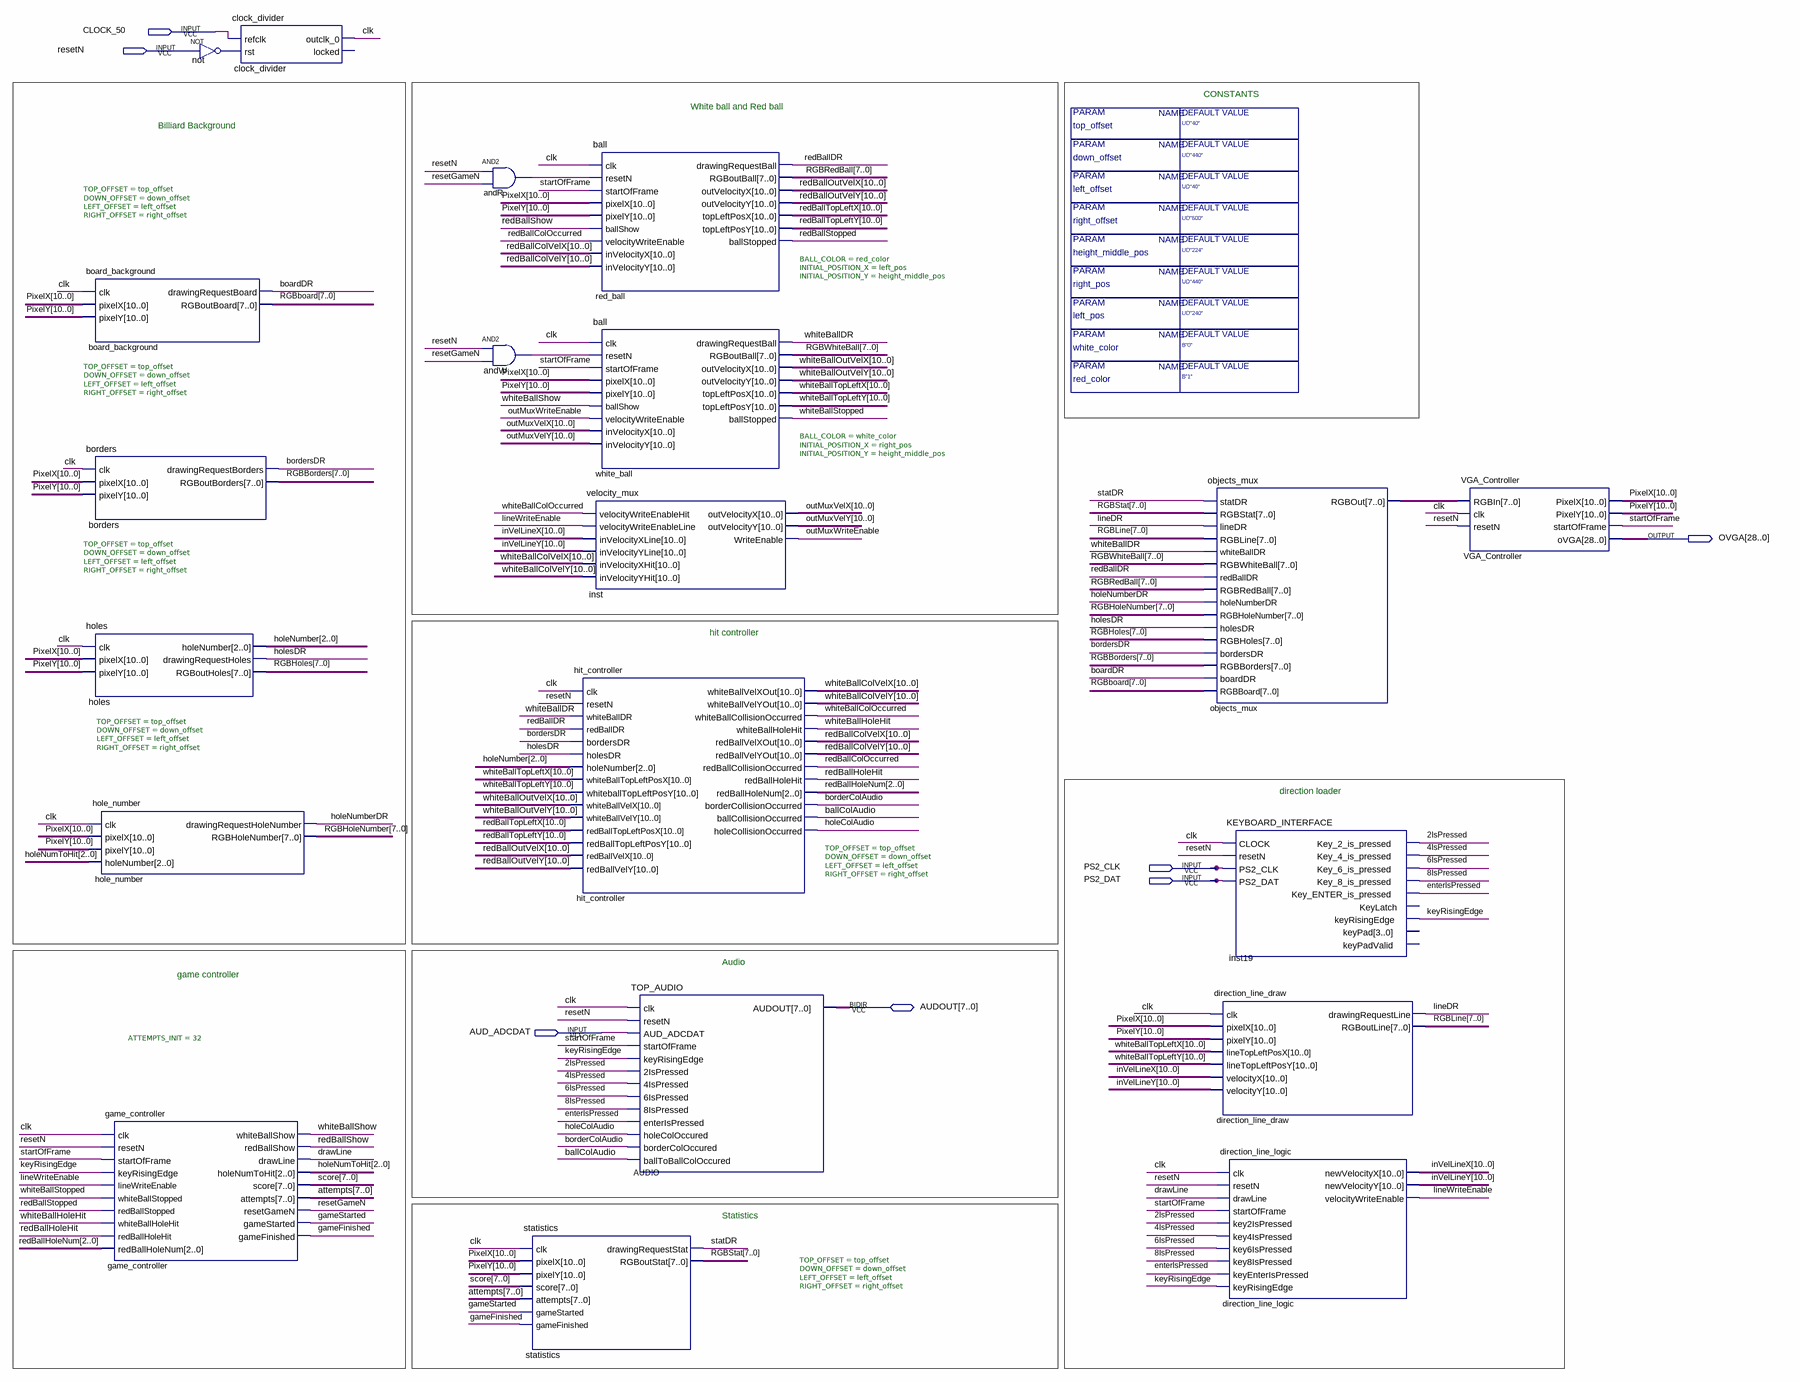
[diagram p0: schematic sheet]
// Quartus schematic BILLIARD_GAME.bdf as structural Verilog: 20 symbols, 7 pins
module BILLIARD_GAME #(parameter height_middle_pos = "UD\"224\"", parameter right_pos = "UD\"440\"", parameter left_pos = "UD\"240\"", parameter white_color = 'b0, parameter red_color = 'b1, parameter top_offset = "UD\"40\"", parameter down_offset = "UD\"440\"", parameter left_offset = "UD\"40\"", parameter right_offset = "UD\"600\"") (
  input  CLOCK_50,
  input  resetN,
  input  PS2_CLK,
  input  PS2_DAT,
  input  AUD_ADCDAT,
  inout  [7:0] AUDOUT,
  output [28:0] OVGA
);

  wire \2IsPressed , \4IsPressed , \6IsPressed , \8IsPressed , andR_out, andW_out, ballColAudio, boardDR,
       borderColAudio, bordersDR, clk, drawLine, enterIsPressed, gameFinished, gameStarted, holeColAudio,
       holeNumberDR, holesDR, keyRisingEdge, lineDR, lineWriteEnable, not_out, outMuxWriteEnable,
       redBallColOccurred, redBallDR, redBallHoleHit, redBallShow, redBallStopped, resetGameN, startOfFrame,
       statDR, whiteBallColOccurred, whiteBallDR, whiteBallHoleHit, whiteBallShow, whiteBallStopped;
  wire [2:0] holeNumber, holeNumToHit, redBallHoleNum;
  wire [7:0] attempts, objects_mux_rgbout, RGBboard, RGBBorders, RGBHoleNumber, RGBHoles, RGBLine,
       RGBRedBall, RGBStat, RGBWhiteBall, score;
  wire [10:0] inVelLineX, inVelLineY, outMuxVelX, outMuxVelY, PixelX, PixelY, redBallColVelX, redBallColVelY,
       redBallOutVelX, redBallOutVelY, redBallTopLeftX, redBallTopLeftY, whiteBallColVelX, whiteBallColVelY,
       whiteBallOutVelX, whiteBallOutVelY, whiteBallTopLeftX, whiteBallTopLeftY;

  board_background #(.TOP_OFFSET(top_offset), .DOWN_OFFSET(down_offset), .LEFT_OFFSET(left_offset), .RIGHT_OFFSET(right_offset)) board_background (
    .clk(clk), .pixelX(PixelX), .pixelY(PixelY), .drawingRequestBoard(boardDR), .RGBoutBoard(RGBboard));
  borders #(.TOP_OFFSET(top_offset), .DOWN_OFFSET(down_offset), .LEFT_OFFSET(left_offset), .RIGHT_OFFSET(right_offset)) borders (
    .clk(clk), .pixelX(PixelX), .pixelY(PixelY), .drawingRequestBorders(bordersDR), .RGBoutBorders(RGBBorders));
  holes #(.TOP_OFFSET(top_offset), .DOWN_OFFSET(down_offset), .LEFT_OFFSET(left_offset), .RIGHT_OFFSET(right_offset)) holes (
    .clk(clk), .pixelX(PixelX), .pixelY(PixelY), .holeNumber(holeNumber), .drawingRequestHoles(holesDR),
    .RGBoutHoles(RGBHoles));
  hole_number #(.TOP_OFFSET(top_offset), .DOWN_OFFSET(down_offset), .LEFT_OFFSET(left_offset), .RIGHT_OFFSET(right_offset)) hole_number (
    .clk(clk), .pixelX(PixelX), .pixelY(PixelY), .holeNumber(holeNumToHit),
    .drawingRequestHoleNumber(holeNumberDR), .RGBHoleNumber(RGBHoleNumber));
  game_controller #(.ATTEMPTS_INIT(32)) game_controller (
    .clk(clk), .resetN(resetN), .startOfFrame(startOfFrame), .keyRisingEdge(keyRisingEdge),
    .lineWriteEnable(lineWriteEnable), .whiteBallStopped(whiteBallStopped), .redBallStopped(redBallStopped),
    .whiteBallHoleHit(whiteBallHoleHit), .redBallHoleHit(redBallHoleHit), .redBallHoleNum(redBallHoleNum),
    .whiteBallShow(whiteBallShow), .redBallShow(redBallShow), .drawLine(drawLine),
    .holeNumToHit(holeNumToHit), .score(score), .attempts(attempts), .resetGameN(resetGameN),
    .gameStarted(gameStarted), .gameFinished(gameFinished));
  clock_divider clock_divider (.refclk(CLOCK_50), .rst(not_out), .outclk_0(clk));  // open: locked
  not \not  (not_out, resetN);
  and andR (andR_out, resetN, resetGameN);
  and andW (andW_out, resetN, resetGameN);
  statistics #(.TOP_OFFSET(top_offset), .DOWN_OFFSET(down_offset), .LEFT_OFFSET(left_offset), .RIGHT_OFFSET(right_offset)) statistics (
    .clk(clk), .pixelX(PixelX), .pixelY(PixelY), .score(score), .attempts(attempts),
    .gameStarted(gameStarted), .gameFinished(gameFinished), .drawingRequestStat(statDR), .RGBoutStat(RGBStat));
  ball #(.BALL_COLOR(red_color), .INITIAL_POSITION_X(left_pos), .INITIAL_POSITION_Y(height_middle_pos)) red_ball (
    .clk(clk), .resetN(andR_out), .startOfFrame(startOfFrame), .pixelX(PixelX), .pixelY(PixelY),
    .ballShow(redBallShow), .velocityWriteEnable(redBallColOccurred), .inVelocityX(redBallColVelX),
    .inVelocityY(redBallColVelY), .drawingRequestBall(redBallDR), .RGBoutBall(RGBRedBall),
    .outVelocityX(redBallOutVelX), .outVelocityY(redBallOutVelY), .topLeftPosX(redBallTopLeftX),
    .topLeftPosY(redBallTopLeftY), .ballStopped(redBallStopped));
  ball #(.BALL_COLOR(white_color), .INITIAL_POSITION_X(right_pos), .INITIAL_POSITION_Y(height_middle_pos)) white_ball (
    .clk(clk), .resetN(andW_out), .startOfFrame(startOfFrame), .pixelX(PixelX), .pixelY(PixelY),
    .ballShow(whiteBallShow), .velocityWriteEnable(outMuxWriteEnable), .inVelocityX(outMuxVelX),
    .inVelocityY(outMuxVelY), .drawingRequestBall(whiteBallDR), .RGBoutBall(RGBWhiteBall),
    .outVelocityX(whiteBallOutVelX), .outVelocityY(whiteBallOutVelY), .topLeftPosX(whiteBallTopLeftX),
    .topLeftPosY(whiteBallTopLeftY), .ballStopped(whiteBallStopped));
  velocity_mux inst (
    .velocityWriteEnableHit(whiteBallColOccurred), .velocityWriteEnableLine(lineWriteEnable),
    .inVelocityXLine(inVelLineX), .inVelocityYLine(inVelLineY), .inVelocityXHit(whiteBallColVelX),
    .inVelocityYHit(whiteBallColVelY), .outVelocityX(outMuxVelX), .outVelocityY(outMuxVelY),
    .WriteEnable(outMuxWriteEnable));
  hit_controller #(.TOP_OFFSET(top_offset), .DOWN_OFFSET(down_offset), .LEFT_OFFSET(left_offset), .RIGHT_OFFSET(right_offset)) hit_controller (
    .clk(clk), .resetN(resetN), .whiteBallDR(whiteBallDR), .redBallDR(redBallDR), .bordersDR(bordersDR),
    .holesDR(holesDR), .holeNumber(holeNumber), .whiteBallTopLeftPosX(whiteBallTopLeftX),
    .whiteballTopLeftPosY(whiteBallTopLeftY), .whiteBallVelX(whiteBallOutVelX),
    .whiteBallVelY(whiteBallOutVelY), .redBallTopLeftPosX(redBallTopLeftX),
    .redBallTopLeftPosY(redBallTopLeftY), .redBallVelX(redBallOutVelX), .redBallVelY(redBallOutVelY),
    .whiteBallVelXOut(whiteBallColVelX), .whiteBallVelYOut(whiteBallColVelY),
    .whiteBallCollisionOccurred(whiteBallColOccurred), .whiteBallHoleHit(whiteBallHoleHit),
    .redBallVelXOut(redBallColVelX), .redBallVelYOut(redBallColVelY),
    .redBallCollisionOccurred(redBallColOccurred), .redBallHoleHit(redBallHoleHit),
    .redBallHoleNum(redBallHoleNum), .borderCollisionOccurred(borderColAudio),
    .ballCollisionOccurred(ballColAudio), .holeCollisionOccurred(holeColAudio));
  TOP_AUDIO AUDIO (
    .clk(clk), .resetN(resetN), .AUD_ADCDAT(AUD_ADCDAT), .startOfFrame(startOfFrame),
    .keyRisingEdge(keyRisingEdge), .\2IsPressed (\2IsPressed ), .\4IsPressed (\4IsPressed ),
    .\6IsPressed (\6IsPressed ), .\8IsPressed (\8IsPressed ), .enterIsPressed(enterIsPressed),
    .holeColOccured(holeColAudio), .borderColOccured(borderColAudio), .ballToBallColOccured(ballColAudio),
    .AUDOUT(AUDOUT));
  objects_mux objects_mux (
    .statDR(statDR), .RGBStat(RGBStat), .lineDR(lineDR), .RGBLine(RGBLine), .whiteBallDR(whiteBallDR),
    .RGBWhiteBall(RGBWhiteBall), .redBallDR(redBallDR), .RGBRedBall(RGBRedBall), .holeNumberDR(holeNumberDR),
    .RGBHoleNumber(RGBHoleNumber), .holesDR(holesDR), .RGBHoles(RGBHoles), .bordersDR(bordersDR),
    .RGBBorders(RGBBorders), .boardDR(boardDR), .RGBBoard(RGBboard), .RGBOut(objects_mux_rgbout));
  KEYBOARD_INTERFACE inst19 (
    .CLOCK(clk), .resetN(resetN), .PS2_CLK(PS2_CLK), .PS2_DAT(PS2_DAT), .Key_2_is_pressed(\2IsPressed ),
    .Key_4_is_pressed(\4IsPressed ), .Key_6_is_pressed(\6IsPressed ), .Key_8_is_pressed(\8IsPressed ),
    .Key_ENTER_is_pressed(enterIsPressed), .keyRisingEdge(keyRisingEdge));  // open: KeyLatch, keyPad, keyPadValid
  direction_line_draw direction_line_draw (
    .clk(clk), .pixelX(PixelX), .pixelY(PixelY), .lineTopLeftPosX(whiteBallTopLeftX),
    .lineTopLeftPosY(whiteBallTopLeftY), .velocityX(inVelLineX), .velocityY(inVelLineY),
    .drawingRequestLine(lineDR), .RGBoutLine(RGBLine));
  direction_line_logic direction_line_logic (
    .clk(clk), .resetN(resetN), .drawLine(drawLine), .startOfFrame(startOfFrame),
    .key2IsPressed(\2IsPressed ), .key4IsPressed(\4IsPressed ), .key6IsPressed(\6IsPressed ),
    .key8IsPressed(\8IsPressed ), .keyEnterIsPressed(enterIsPressed), .keyRisingEdge(keyRisingEdge),
    .newVelocityX(inVelLineX), .newVelocityY(inVelLineY), .velocityWriteEnable(lineWriteEnable));
  VGA_Controller VGA_Controller (
    .RGBIn(objects_mux_rgbout), .clk(clk), .resetN(resetN), .PixelX(PixelX), .PixelY(PixelY),
    .startOfFrame(startOfFrame), .oVGA(OVGA));

  // Notes on the sheet:
  //   CONSTANTS
  //   White ball and Red ball
  //   Billiard Background
  //   hit controller
  //   direction loader
  //   Audio
  //   game controller
  //   Statistics
endmodule
